# Altium schematic sheet Sheet2.SchDoc
size A4; CompanyName: Ultimaker; Revision: rev. 2.0.2
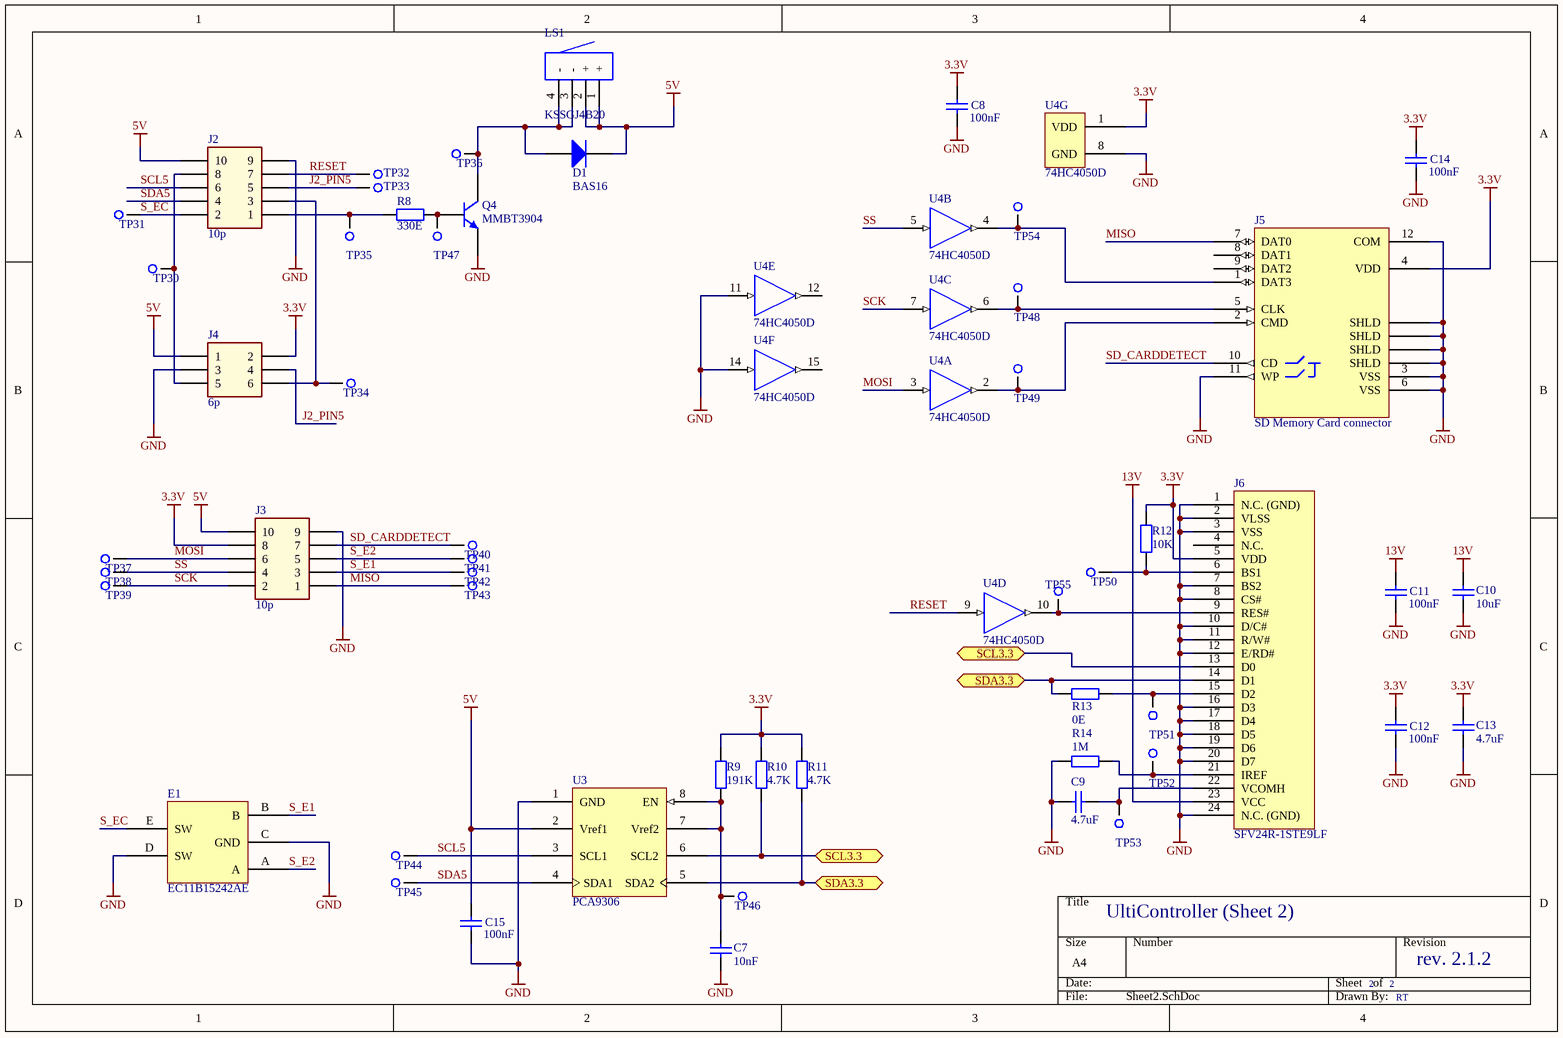
[diagram p0: Sheet2.SchDoc]

## Parts
C7  10nF  [C0805 (2012)]
C8  100nF  [C0805 (2012)]
C9  4.7uF  [C1206 (3216)]
C10  10uF  [C1206 (3216)]
C11  100nF  [C0805 (2012)]
C12  100nF  [C0805 (2012)]
C13  4.7uF  [C1206 (3216)]
C14  100nF  [C0805 (2012)]
C15  100nF  [C0805 (2012)]
D1  BAS16  [IC SOT23]
E1  EC11B15242AE  [Misc EC11B15242AE]
J2  10p  [HEADER 10P right angle]
J3  10p  [HEADER 10P right angle]
J4  6p  [HEADER 6P RIGHT ANGLE]
J5  SD Memory Card connector  [CON SD-Card]
J6  SFV24R-1STE9LF  [Con SFV24R-1STE9LF]
LS1  KSSGJ4B20  [Buzzer KSSGJ4B20]
Q4  MMBT3904  [IC SOT23]
R8  330E  [R0805 (2012)]
R9  191K  [R0805 (2012)]
R10  4.7K  [R0805 (2012)]
R11  4.7K  [R0805 (2012)]
R12  10K  [R0805 (2012)]
R13  0E  [R0805 (2012)]
R14  1M  [R0805 (2012)]
TP30  2mm  [TESTPOINT 2mm]  (value not drawn)  (no BOM)
TP31  2mm  [TESTPOINT 2mm]  (value not drawn)  (no BOM)
TP32  2mm  [TESTPOINT 2mm]  (value not drawn)  (no BOM)
TP33  2mm  [TESTPOINT 2mm]  (value not drawn)  (no BOM)
TP34  2mm  [TESTPOINT 2mm]  (value not drawn)  (no BOM)
TP35  2mm  [TESTPOINT 2mm]  (value not drawn)  (no BOM)
TP36  2mm  [TESTPOINT 2mm]  (value not drawn)  (no BOM)
TP37  2mm  [TESTPOINT 2mm]  (value not drawn)  (no BOM)
TP38  2mm  [TESTPOINT 2mm]  (value not drawn)  (no BOM)
TP39  2mm  [TESTPOINT 2mm]  (value not drawn)  (no BOM)
TP40  2mm  [TESTPOINT 2mm]  (value not drawn)  (no BOM)
TP41  2mm  [TESTPOINT 2mm]  (value not drawn)  (no BOM)
TP42  2mm  [TESTPOINT 2mm]  (value not drawn)  (no BOM)
TP43  2mm  [TESTPOINT 2mm]  (value not drawn)  (no BOM)
TP44  2mm  [TESTPOINT 2mm]  (value not drawn)  (no BOM)
TP45  2mm  [TESTPOINT 2mm]  (value not drawn)  (no BOM)
TP46  2mm  [TESTPOINT 2mm]  (value not drawn)  (no BOM)
TP47  2mm  [TESTPOINT 2mm]  (value not drawn)  (no BOM)
TP48  2mm  [TESTPOINT 2mm]  (value not drawn)  (no BOM)
TP49  2mm  [TESTPOINT 2mm]  (value not drawn)  (no BOM)
TP50  2mm  [TESTPOINT 2mm]  (value not drawn)  (no BOM)
TP51  2mm  [TESTPOINT 2mm]  (value not drawn)  (no BOM)
TP52  2mm  [TESTPOINT 2mm]  (value not drawn)  (no BOM)
TP53  2mm  [TESTPOINT 2mm]  (value not drawn)  (no BOM)
TP54  2mm  [TESTPOINT 2mm]  (value not drawn)  (no BOM)
TP55  2mm  [TESTPOINT 2mm]  (value not drawn)  (no BOM)
U3  PCA9306  [IC SSOP-8]
U4  74HC4050D  [IC SOIC-16]  (parts A,B,C,D,E,F,G of 7)

## Ports
SCL3.3 (bidir), SDA3.3 (bidir)

## Nets
3.3V: C8.2 C12.2 C13.1 C14.2 J3.8 J4.2 J5.4(VDD) J6.5(VDD) R9.2 R10.2 R11.2 R12.2 U4.1(VDD)
5V: C15.2 D1.3(K) J2.10 J3.10 J4.1 LS1.1(+) LS1.2(+) U3.2(Vref1)
13V: C10.2 C11.2 J6.23(VCC)
GND: C7.1 C8.1 C9.2 C10.1 C11.1 C12.1 C13.2 C14.1 C15.1 E1.C(GND) E1.D(SW) J2.9 J3.9 J4.3 J5.3(VSS) J5.6(VSS) J5.11(WP) J5.12(COM) J5.A(SHLD) J5.B(SHLD) J5.C(SHLD) J5.D(SHLD) J6.1(N.C._(GND)) J6.2(VLSS) J6.3(VSS) J6.7(BS2) J6.8(CS#) J6.10(D/C#) J6.11(R/W#) J6.12(E/RD#) J6.16(D3) J6.17(D4) J6.18(D5) J6.19(D6) J6.20(D7) J6.24(N.C._(GND)) Q4.2(E) R14.1 U3.1(GND) U4.8(GND) U4.11(A) U4.14(A)
J2_PIN5: J2.5 J4.4 TP33.1
MISO: J3.1 J5.7(DAT0) TP43.1
MOSI: J3.6 TP37.1 U4.3(A)
RESET: J2.7 TP32.1 U4.9(A)
S_E1: E1.B J3.3 TP42.1
S_E2: E1.A J3.5 TP41.1
S_EC: E1.E(SW) J2.2 TP31.1
SCK: J3.2 TP39.1 U4.7(A)
SCL3.3: J6.13(D0) R10.1 U3.6(SCL2) ; port SCL3.3
SCL5: J2.6 TP44.1 U3.3(SCL1)
SD_CARDDETECT: J3.7 J5.10(CD) TP40.1
SDA3.3: J6.14(D1) R11.1 R13.1 U3.5(SDA2) ; port SDA3.3
SDA5: J2.4 TP45.1 U3.4(SDA1)
SS: J3.4 TP38.1 U4.5(A)
NetC7_2: C7.2 R9.1 TP46.1 U3.7(Vref2) U3.8(EN)
NetC9_1: C9.1 J6.22(VCOMH) TP53.1
NetD1_1: D1.1(A) LS1.3(-) LS1.4(-) Q4.3(C) TP36.1
NetJ2_1: J2.1 R8.1 TP35.1
NetJ2_3: J2.3 J4.6 TP34.1
NetJ2_8: J2.8 J4.5 TP30.1
NetJ5_1: J5.1(DAT3) TP54.1 U4.4(Y)
NetJ5_2: J5.2(CMD) TP49.1 U4.2(Y)
NetJ5_5: J5.5(CLK) TP48.1 U4.6(Y)
NetJ6_6: J6.6(BS1) R12.1 TP50.1
NetJ6_9: J6.9(RES#) TP55.1 U4.10(Y)
NetJ6_15: J6.15(D2) R13.2 TP51.1
NetJ6_21: J6.21(IREF) R14.2 TP52.1
NetQ4_1: Q4.1(B) R8.2 TP47.1

Not connected (* = marked no-connect by the designer): J5 8(DAT1) 9(DAT2); J6 4(N.C.); U4 12(Y) 15(Y)

## Notes on the sheet
- UltiController (Sheet 2)
- 2
- rev. 2.1.2
- RT

## Library data of the parts
C7 = Cap 10nF X7R 0805: Cap 10nF X7R 0805 10% 100V; Mfg: AVX; Mfg code: 08051C103K4Z2A; Faber ItemCode: -; Max soldering temp: -; Remarks: -; Supplier: Farnell; Supplier code: 1833850; SMD: Yes; Value: 10nF
C8 C11 C12 C14 C15 = Cap 100nF X7R 0805: Cap 100nF X7R 0805 10% 100V; Mfg: AVX; Mfg code: 08051C104K4T2A; Faber ItemCode: -; Max soldering temp: -; Remarks: -; Supplier: Farnell; Supplier code: 1833888; Value: 100nF; SMD: Yes
C9 C13 = Cap 4.7uF X7R 1206: Cap 4.7uF 1206 X7R 10% 25V; Mfg: TDK; Mfg code: C3216X7R1E475K160AC; Faber ItemCode: -; Max soldering temp: -; Remarks: -; Supplier: Farnell; Supplier code: 1907356; Value: 4.7uF; SMD: Yes
C10 = Cap 10uF X7R 1206: Cap 10uF 1206 X7R 10% 25V; Mfg: KEMET; Mfg code: C1206C106K3RAC TU; Faber ItemCode: -; Max soldering temp: -; Remarks: -; Supplier: Farnell; Supplier code: 2118134; Value: 10uF; SMD: Yes
D1 = Diode BAS16: Diode BAS16  SOT23 85V 215MA; Mfg: NXP; Faber ItemCode: -; Max soldering temp: -; Mfg code: BAS16; Remarks: -; SMD: Yes; Supplier: Farnell; Supplier code: 1081180; Value: -
E1 = Misc EC11B15242AE: Misc EC11B15242AE encoder horiz; Mfg: ALPS; Faber ItemCode: -; Max soldering temp: -; Mfg code: EC11B15242AE; Remarks: -; SMD: No; Supplier: Farnell; Supplier code: 2064978; Value: -
J2 J3 = Header 10p: Header 2x5p right angle 2.54mm; Mfg: WURTH ELEKTRONIK; Mfg code: 61201021721; Value: -; Faber ItemCode: -; Max soldering temp: -; Remarks: -; SMD: No; Supplier: Farnell; Supplier code: 1642023
J4 = Header 6p r.a.: Header 2x3p right angle 2.54mm; Mfg: FCI; Mfg code: 68021-206HLF; Value: -; Faber ItemCode: -; Max soldering temp: -; Remarks: -; SMD: No; Supplier: Digikey; Supplier code: 609-3343-ND
J5 = Connector SD-Card-Hirose: Connector Std,reverse SD Memory Card connector; Faber ItemCode: 36966100; Mfg: HRS (HIROSE); Mfg code: DM1AA-SF-PEJ(72); Faber Artikelomschrijving: SD-KAARDHOUDER SMD DM1AA-SF-PEJ(72) HIROSE; Bestel grote: 1; Prijs: 3,02; Value: -; Max soldering temp: -; Remarks: -; SMD: Yes; Supplier: Mouser; Supplier code: 798-DM1AA-SF-PEJ72
J6 = Connector SFV24R-1STE9LF: Connector FPC/FFC 0.5mm R/A 24p SMD; Mfg: FCI; Faber ItemCode: -; Max soldering temp: -; Mfg code: SFV24R-1STE9LF; Remarks: -; SMD: Yes; Supplier: Farnell; Supplier code: 1830598; Value: -
LS1 = Buzzer KSSGJ4B20: Buzzer KSSGJ4B20 SMD; Mfg: KINGSTATE; Faber ItemCode: -; Max soldering temp: -; Mfg code: KSSGJ4B20; Remarks: -; SMD: Yes; Supplier: Farnell; Supplier code: 1502710; Value: -
Q4 = NPN MMBT3904: NPN MMBT3904 SOT-23 200mA; Mfg: NXP; Mfg code: MMBT3904,215; Faber ItemCode: -; Max soldering temp: -; Remarks: -; Supplier: Farnell; Supplier code: 1757935; Value: -; SMD: Yes
R8 = Res 330E 0805: Res 330E 0805 1% 100mW; Mfg: MULTICOMP; Mfg code: MC 0.1W 0805 1% 330R; Faber ItemCode: -; Max soldering temp: -; Remarks: -; Supplier: Farnell; Supplier code: 9333037; Value: 330E; SMD: Yes
R9 = Res 191K 0805: Res 191K 0805 1% 125mW; Mfg: VISHAY DRALORIC; Mfg code: CRCW0805191KFKEA; Faber ItemCode: -; Max soldering temp: -; Remarks: -; Supplier: Farnell; Supplier code: 2139049; Value: 191K; SMD: Yes
R10 R11 = Res 4.7K 0805: Res 4.7K 0805 1% 100mW; Mfg: MULTICOMP; Mfg code: MC 0.1W 0805 1% 4K7; Faber ItemCode: -; Max soldering temp: -; Remarks: -; Supplier: Farnell; Supplier code: 9333266; Value: 4.7K; SMD: Yes
R12 = Res 10K 0805: Res 10K 0805 1% 100mW; Mfg: MULTICOMP; Mfg code: MC 0.1W 0805 1% 10K; Faber ItemCode: -; Max soldering temp: -; Remarks: -; Supplier: Farnell; Supplier code: 9332391; Value: 10K; SMD: Yes
R13 = Res 0E 0805: Res 0E 0805 1% 100mW; Mfg: MULTICOMP; Mfg code: MC 0.1W 0805 0R; Faber ItemCode: -; Max soldering temp: -; Remarks: -; Supplier: Farnell; Supplier code: 9333681; Value: 0E; SMD: Yes
R14 = Res 1M 0805: Res 1M 0805 1% 100mW; Mfg: MULTICOMP; Mfg code: MC 0.1W 0805 1% 1M; Faber ItemCode: -; Max soldering temp: -; Remarks: -; Supplier: Farnell; Supplier code: 9332413; Value: 1M; SMD: Yes
TP30-TP55 = Testpoint, 2mm, round: Remarks: Not a component; Faber ItemCode: -; Mfg: -; Mfg code: -; Value: -; Supplier: -; Supplier code: -; Max soldering temp: -
U3 = IC PCA9306: IC PCA9306 Voltage Level translator; Mfg: TEXAS INSTRUMENTS; Mfg code: PCA9306DCTR; Faber ItemCode: -; Max soldering temp: -; Remarks: -; SMD: Yes; Supplier: Farnell; Supplier code: 1470936; Value: -
U4 = IC 74HC4050D: IC Hex Non-Inverting Buffer/Logic-Level Down Converter; Faber ItemCode: 35592900; Mfg: NXP; Faber Artikelomschrijving: IC 74HC4050D SO-16 NXP; Bestel grote: 2500; Prijs: 0,0878; Max soldering temp: -; Mfg code: 74HC4050D; Remarks: -; SMD: Yes; Supplier: Arrow CE GmbH; Supplier code: 74HC4050D,653 (T&R); Value: -